# Altium schematic sheet BatteryMonitor.SchDoc: Titel
size A3; ApprovedBy: name; CompanyName: DCI Electronics bv; DrawnBy: KRS; Address1: Nijverheidsstraat 14; Address2: 4458 AV Eindewege; Address3: Phone: +31 (0)113 344880; DocumentNumber: 8; Revision: 2; SheetNumber: 8; SheetTotal: 14; PageSetup: Record=PageOptions|CenterHorizontal=True|CenterVertical=True|PrintScale=1.00|XCorrection=1.00|YCorrection=1.00|PrintKind=1|BorderSize=5000000|LeftOffset=0|BottomOffset=0|Orientation=2|PaperLength=1000|PaperWidth=1000|Scale=100|PaperSource=7|PrintQuality=-4|MediaType=1|DitherType=10|PaperKind=ISO_A4_(210.00_x_297.00_MM)|PrintScaleMode=1; SubTitle: SubTitel; ApprovedDate: 01-01-12; DesignedBy: KRS
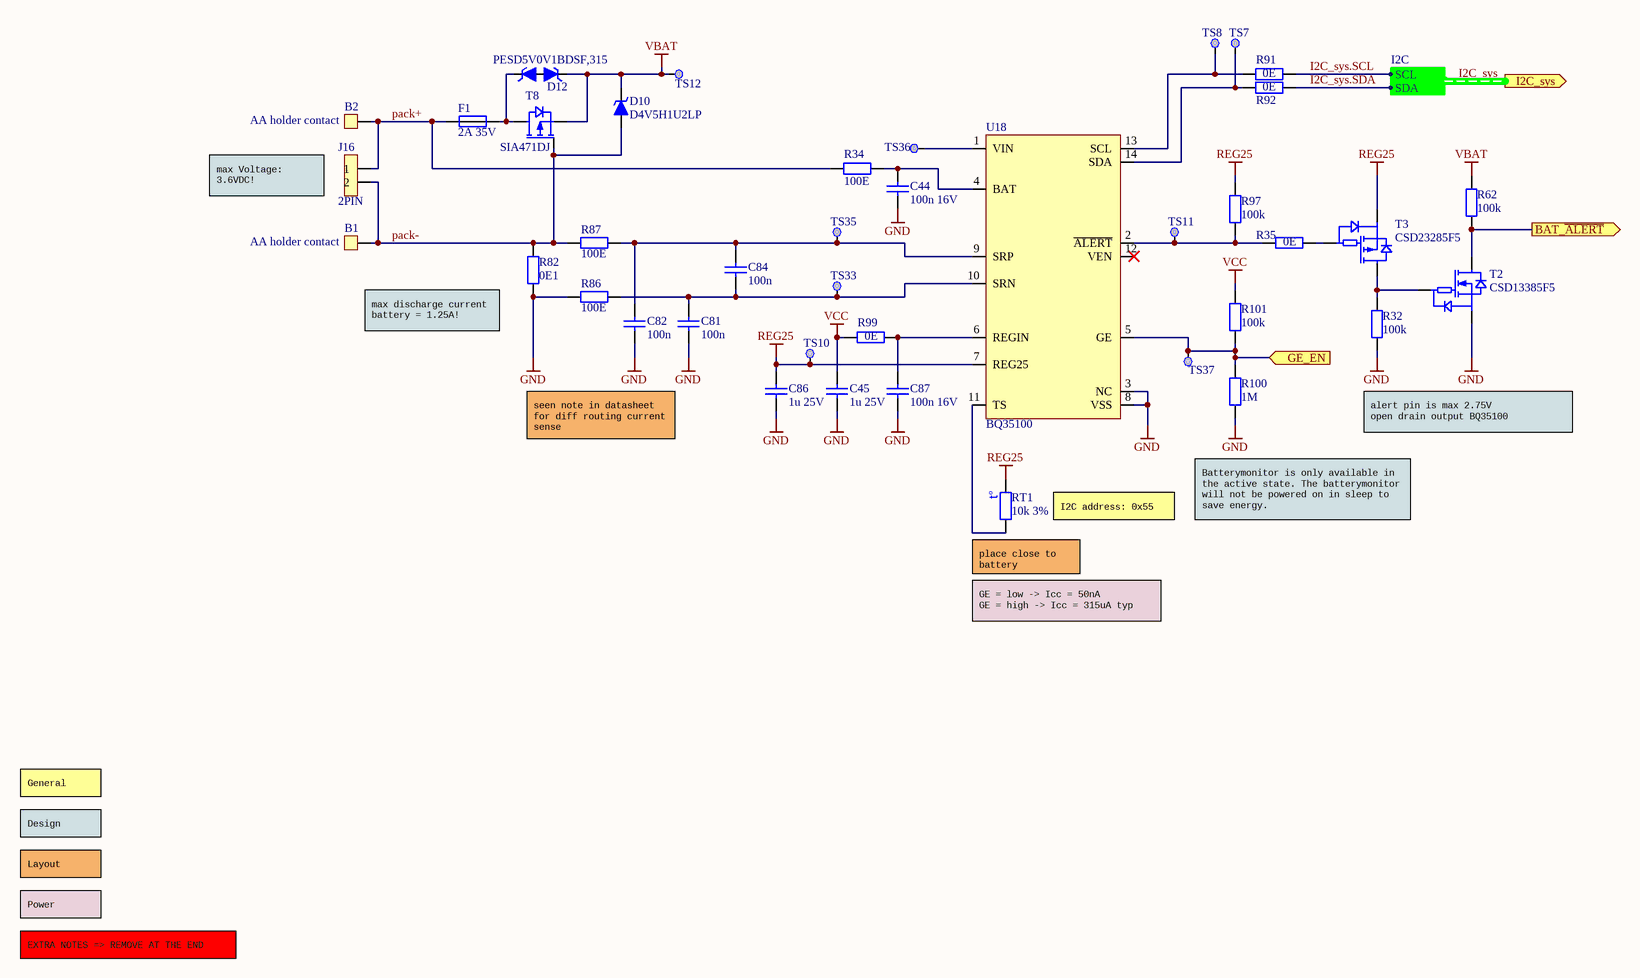
[diagram p0: BatteryMonitor.SchDoc]

## Parts
B1  AA holder contact  [ADD-900G002-000]
B2  AA holder contact  [ADD-900G002-000]
C44  100n 16V  [CAPC1005X05N]
C45  1u 25V  [CAPC1608X09N]
C81  100n  [CAPC1608X09N]
C82  100n  [CAPC1608X09N]
C84  100n  [CAPC1608X09N]
C86  1u 25V  [CAPC1608X09N]
C87  100n 16V  [CAPC1005X05N]
D10  D4V5H1U2LP  [DFN110P160X55-2N]
D12  PESD5V0V1BDSF,315  [DIO-000G003-002]
F1  2A 35V  [Fuse1608X05N]
J16  2PIN  [JST-B2B-PH-SM4-TB]
R32  100k  [RESC1005X04N]
R34  100E  [RESC1005X04N]
R35  0E  [RESC1005X04N]
R62  100k  [RESC1005X04N]
R82  0E1  [RESC3116X13L]
R86  100E  [RESC1608X13N]
R87  100E  [RESC1608X13N]
R91  0E  [RESC1005X04N]
R92  0E  [RESC1005X04N]
R97  100k  [RESC1005X04N]
R99  0E  [RESC1005X04N]
R100  1M  [RESC1005x04N]
R101  100k  [RESC1005X04N]
RT1  10k 3%  [RESC2013X14M]
T2  CSD13385F5  [DFN-500G000-003]
T3  CSD23285F5  [DFN-500G000-003]
T8  SIA471DJ  [PAK-SC70-6]
TS7  TESTPAD  [TESTPAD 2MM]  (value not drawn)  (no BOM)
TS8  TESTPAD  [TESTPAD 2MM]  (value not drawn)  (no BOM)
TS10  TESTPAD  [TESTPAD 2MM]  (value not drawn)  (no BOM)
TS11  TESTPAD  [TESTPAD 2MM]  (value not drawn)  (no BOM)
TS12  TESTPAD  [TESTPAD 2MM]  (value not drawn)  (no BOM)
TS33  TESTPOINT  [testpad 1.5 mm]  (value not drawn)  (no BOM)
TS35  TESTPOINT  [testpad 1.5 mm]  (value not drawn)  (no BOM)
TS36  TESTPAD  [TESTPAD 2MM]  (value not drawn)  (no BOM)
TS37  TESTPAD  [TESTPAD 2MM]  (value not drawn)  (no BOM)
U18  BQ35100  [SOP-650G001-014]

## Ports
BAT_~{ALERT} (out), GE_EN (in), I2C_sys (out, harness I2C)

## Harnesses
I2C: SDA, SCL

## Nets
GND: C44.1 C45.1 C81.1 C82.1 C86.1 C87.1 R32.1 R82.1 R86.1 R100.1 T2.S U18.3(NC) U18.8(VSS)
REG25: C86.2 R97.2 RT1.1 T3.S TS10.1(TP) U18.7(REG25)
VBAT: D10.C D12.C1 R62.2 T8.S TS12.1(TP)
VCC: C45.2 R99.1 R101.2
BAT_~{ALERT}: R62.1 T2.D ; port BAT_~{ALERT}
GE_EN: R100.2 R101.1 TS37.1(TP) U18.5(GE) ; port GE_EN
I2C_sys.SCL: R91.2 ; port I2C_sys.SCL
I2C_sys.SDA: R92.2 ; port I2C_sys.SDA
pack+: B2.1 F1.2 J16.1 R34.1
pack-: B1.1 D10.A J16.2 R82.2 R87.1 T8.G
NetC44_2: C44.2 R34.2 U18.4(BAT)
NetC81_2: C81.2 C84.1 R86.2 TS33.1(TP) U18.10(SRN)
NetC82_2: C82.2 C84.2 R87.2 TS35.1(TP) U18.9(SRP)
NetC87_2: C87.2 R99.2 U18.6(REGIN)
NetD12_C2: D12.C2 F1.1 T8.D
NetR32_2: R32.2 T2.G T3.D
NetR35_1: R35.1 R97.1 TS11.1(TP) U18.2(~{ALERT})
NetR35_2: R35.2 T3.G
NetR91_1: R91.1 TS8.1(TP) U18.13(SCL)
NetR92_1: R92.1 TS7.1(TP) U18.14(SDA)
NetRT1_2: RT1.2 U18.11(TS)
NetTS36_1: TS36.1(TP) U18.1(VIN)

Not connected (* = marked no-connect by the designer): U18 12(VEN)*

## Buses and harness runs
harness I2C_sys = port I2C_sys

## Notes on the sheet
- max Voltage: 3.6VDC!
- max discharge current battery = 1.25A!
- seen note in datasheet for diff routing current sense
- alert pin is max 2.75V
  open drain output BQ35100
- (near RT1) place close to battery
- (near RT1) I2C address: 0x55
- Batterymonitor is only available in the active state. The batterymonitor will not be powered on in sleep to save energy.
- GE = low -> Icc = 50nA
  GE = high -> Icc = 315uA typ
- Design
- General
- Layout
- Power
- EXTRA NOTES => REMOVE AT THE END
- Designed by:
- Drawing number:
- Variant:
- Date:
- Page:
- Rev:
- Of:
- Dekimo Goes B.V.
- Nijverheidsstraat 14, 4458 AV  Eindewege, Phone: +31 (0)113 344880
- (in symbol R 10K/NTC4) t°

## Library data of the parts
B1 B2 = BAT HLDRAA/1: Battery holder for AA cell; EngPartGrpMainCode: BAT; ManufactpartCode: KEYSTONE 92-KEY; Preferred: False; PartCode: BAT HLDRAA/1; Type: Battery accesoire; SMD_Flag: False
C44 C87 = CKE 100N/70: 100nF, 16V, 10%, X7R; EngPartGrpMainCode: CAP; ManufactpartCode: CC0402KRX7R7BB104-YAG; Type: Capacitor ceramic SMD; Preferred: False; SMD_Flag: True; PartCode: CKE 100N/70
C45 C86 = CKE 1U/61: 1UF, 25V, 10%, 0603, X7R; EngPartGrpMainCode: CAP; ManufactpartCode: CL10B105KA8NNNC-SAM; Type: Capacitor ceramic SMD; Preferred: False; SMD_Flag: True; PartCode: CKE 1U/61
C81 C82 C84 = CKE 100N/60: 100nF 50V 10% X7R; EngPartGrpMainCode: CAP; ManufactpartCode: 2238 586 15649-PHI; Type: Capacitor ceramic SMD; Preferred: False; SMD_Flag: True; PartCode: CKE 100N/60
D10 = DIO D4V5H1U2LP: TVS diode 4,5V unidirec; EngPartGrpMainCode: DIO; ManufactpartCode: D4V5H1U2LP1610-7-DIO; Type: Diode suppressor SMD; Preferred: False; SMD_Flag: True; PartCode: DIO D4V5H1U2LP
D12 = DIO PESD5V0V1BB: TVS diode 5V bidirec; EngPartGrpMainCode: DIO; ManufactpartCode: PESD5V0V1BB-QX-NEX; Type: Diode suppressor SMD; Preferred: False; SMD_Flag: True; PartCode: DIO PESD5V0V1BB
F1 = FUSE 2AT/3: 2A High inrush SMD; ManufactpartCode: SF-0603HI200F-2-BRN; Type: Fuse SMD; Preferred: False; SMD_Flag: True; PartCode: FUSE 2AT/3; EngPartGrpMainCode: FUSE
J16 = CON JSTB2BPHSM4: JST PH 2p top entry 2A SMD; EngPartGrpMainCode: CONN; ManufactpartCode: B2B-PH-SM4-TB(LF)(SN)-JST; Preferred: False; SMD_Flag: True; PartCode: CON JSTB2BPHSM4; Type: Connector Boxed Header SMD
R32 R62 R97 R101 = R 100K/70: 100K, 62.5mW, 1%; EngPartGrpMainCode: RES; ManufactpartCode: RC0402FR-07100KL-YAG; Preferred: False; SMD_Flag: True; PartCode: R 100K/70; Type: Resistor metalfilm SMD
R34 = R 100E/70: 100E, 62.5mW, 1%; EngPartGrpMainCode: RES; ManufactpartCode: RC0402FR-07100RL-YAG; Preferred: False; SMD_Flag: True; PartCode: R 100E/70; Type: Resistor metalfilm SMD
R35 R91 R92 R99 = R 0E/70: 0E, 62.5mW, 1%; PartCode: R 0E/70; EngPartGrpMainCode: RES; ManufactpartCode: RC0402JR-070RL-YAG; Preferred: False; SMD_Flag: True; Type: Resistor metalfilm SMD
R82 = R 0E1/0W5/10: 0E1 1% 0,5W 50ppm; EngPartGrpMainCode: RES; ManufactpartCode: KDV12FR100ET-OHM; Preferred: False; SMD_Flag: True; PartCode: R 0E1/0W5/10; Type: Resistor powerfilm SMD
R86 R87 = R 100E/60: 100E 100mW, 1%; EngPartGrpMainCode: RES; ManufactpartCode: RC0603FR-07100RL-YAG; Preferred: True; PartCode: R 100E/60; Type: Resistor metalfilm SMD; SMD_Flag: True
R100 = R 1M/70: 1M, 62.5mW, 1%; PartCode: R 1M/70; EngPartGrpMainCode: RES; ManufactpartCode: RC0402FR-071ML-YAG; Preferred: False; SMD_Flag: True; Type: Resistor metalfilm SMD
RT1 = R 10K/NTC4: NTC 10K 3% SMD 0805; EngPartGrpMainCode: RES; ManufactpartCode: NTCS0805E3103JMT-VIS; Preferred: False; SMD_Flag: True; PartCode: R 10K/NTC4; Type: Resistor NTC PTC LDR sens. SMD
T2 = TRA CSD13385F5: 7.1A, 12V, N-channel FemtoFet; EngPartGrpMainCode: TRAN; ManufactpartCode: CSD13385F5-TI; Type: FET N-channel SMD; Preferred: False; SMD_Flag: True; PartCode: TRA CSD13385F5
T3 = TRA CSD23285F5: 3.3A, 12V, P-channel FemtoFet; EngPartGrpMainCode: TRAN; ManufactpartCode: CSD23285F5-TI; Type: FET P-channel SMD; Preferred: False; SMD_Flag: True; PartCode: TRA CSD23285F5
T8 = TRA SIA471DJ-T1: 30V 12.9A 0.014E logic level; EngPartGrpMainCode: TRAN; ManufactpartCode: SIA471DJ-T1-GE3-VIS; Type: FET P-channel SMD; Preferred: False; SMD_Flag: True; PartCode: TRA SIA471DJ-T1
TS7 TS8 TS10-TS12 TS36 TS37 = TESTPAD-2.0: 0.5mm Testpad SMD; PartCode: TESTPAD-2.0
U18 = IC BQ35100: Lithium Fuel Gauge; EngPartGrpMainCode: IC; ManufactpartCode: BQ35100PW-TI; Preferred: False; SMD_Flag: True; PartCode: IC BQ35100; Type: IC analog SMD